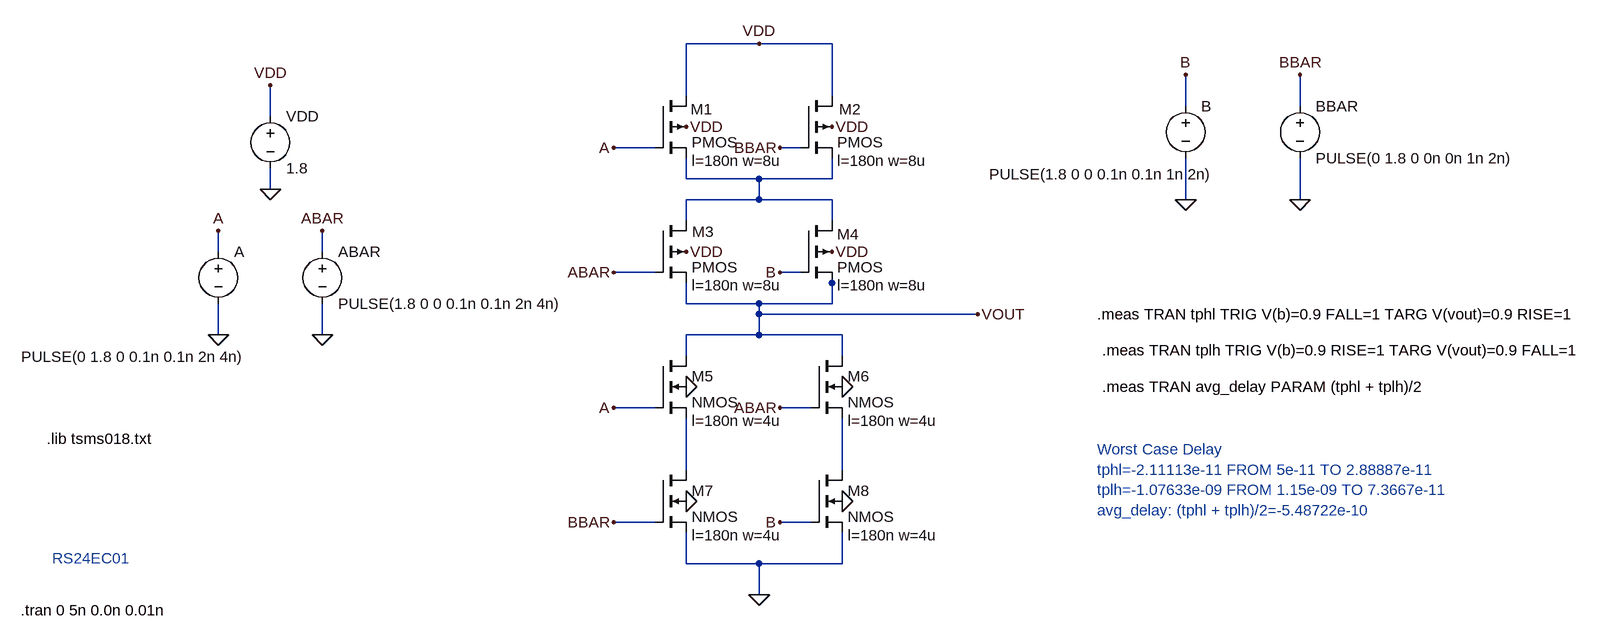
[diagram p0: schematic CMOS_XNOR_GATE.asc]
CMOS_XNOR_GATE.asc, the LTspice schematic file:
Version 4
SHEET 1 1536 872
WIRE 224 -16 112 -16
WIRE 336 -16 224 -16
WIRE 112 64 112 -16
WIRE 336 64 336 -16
WIRE 880 80 880 32
WIRE 1056 80 1056 32
WIRE -528 96 -528 48
WIRE 64 144 0 144
WIRE 288 144 256 144
WIRE 112 192 112 160
WIRE 224 192 112 192
WIRE 336 192 336 160
WIRE 336 192 224 192
WIRE -528 208 -528 176
WIRE 224 224 224 192
WIRE 224 224 112 224
WIRE 336 224 224 224
WIRE 880 224 880 160
WIRE 1056 224 1056 160
WIRE 112 256 112 224
WIRE 336 256 336 224
WIRE -608 304 -608 272
WIRE -448 304 -448 272
WIRE 64 336 0 336
WIRE 288 336 256 336
WIRE 336 352 336 336
WIRE 112 384 112 352
WIRE 224 384 112 384
WIRE 336 384 336 352
WIRE 336 384 224 384
WIRE 224 400 224 384
WIRE 560 400 224 400
WIRE -608 432 -608 384
WIRE -448 432 -448 384
WIRE 224 432 224 400
WIRE 224 432 112 432
WIRE 352 432 224 432
WIRE 112 464 112 432
WIRE 352 464 352 432
WIRE 64 544 0 544
WIRE 304 544 256 544
WIRE 112 640 112 560
WIRE 352 640 352 560
WIRE 64 720 0 720
WIRE 304 720 256 720
WIRE 112 784 112 736
WIRE 224 784 112 784
WIRE 352 784 352 736
WIRE 352 784 224 784
WIRE 224 832 224 784
FLAG 224 832 0
FLAG -528 208 0
FLAG -528 48 VDD
FLAG -608 432 0
FLAG -448 432 0
FLAG -608 272 A
FLAG -448 272 ABAR
FLAG 880 224 0
FLAG 1056 224 0
FLAG 880 32 B
FLAG 1056 32 BBAR
FLAG 224 -16 VDD
FLAG 112 512 0
FLAG 352 512 0
FLAG 112 688 0
FLAG 352 688 0
FLAG 112 112 VDD
FLAG 336 112 VDD
FLAG 112 304 VDD
FLAG 336 304 VDD
FLAG 0 144 A
FLAG 0 544 A
FLAG 256 336 B
FLAG 256 720 B
FLAG 0 336 ABAR
FLAG 256 144 BBAR
FLAG 256 544 ABAR
FLAG 0 720 BBAR
FLAG 560 400 VOUT
SYMBOL pmos4 64 64 R0
WINDOW 0 55 21 Left 2
WINDOW 123 56 100 Left 2
SYMATTR InstName M1
SYMATTR Value2 l=180n w=8u
SYMBOL pmos4 288 64 R0
WINDOW 0 59 21 Left 2
WINDOW 123 56 100 Left 2
SYMATTR InstName M2
SYMATTR Value2 l=180n w=8u
SYMBOL pmos4 64 256 R0
WINDOW 0 57 17 Left 2
WINDOW 123 56 100 Left 2
SYMATTR InstName M3
SYMATTR Value2 l=180n w=8u
SYMBOL pmos4 288 256 R0
WINDOW 0 56 21 Left 2
WINDOW 123 56 100 Left 2
SYMATTR InstName M4
SYMATTR Value2 l=180n w=8u
SYMBOL nmos4 64 464 R0
WINDOW 123 56 100 Left 2
SYMATTR Value2 l=180n w=4u
SYMATTR InstName M5
SYMBOL nmos4 304 464 R0
WINDOW 123 56 100 Left 2
SYMATTR Value2 l=180n w=4u
SYMATTR InstName M6
SYMBOL nmos4 64 640 R0
WINDOW 123 56 100 Left 2
SYMATTR Value2 l=180n w=4u
SYMATTR InstName M7
SYMBOL nmos4 304 640 R0
WINDOW 123 56 100 Left 2
SYMATTR Value2 l=180n w=4u
SYMATTR InstName M8
SYMBOL voltage -528 80 R0
WINDOW 123 0 0 Left 0
WINDOW 39 0 0 Left 0
SYMATTR InstName VDD
SYMATTR Value 1.8
SYMBOL voltage -608 288 R0
WINDOW 3 -303 178 Left 2
WINDOW 123 0 0 Left 0
WINDOW 39 0 0 Left 0
SYMATTR Value PULSE(0 1.8 0 0.1n 0.1n 2n 4n)
SYMATTR InstName A
SYMBOL voltage -448 288 R0
WINDOW 123 0 0 Left 0
WINDOW 39 0 0 Left 0
SYMATTR InstName ABAR
SYMATTR Value PULSE(1.8 0 0 0.1n 0.1n 2n 4n)
SYMBOL voltage 880 64 R0
WINDOW 3 -302 121 Left 2
WINDOW 123 0 0 Left 0
WINDOW 39 0 0 Left 0
SYMATTR Value PULSE(1.8 0 0 0.1n 0.1n 1n 2n)
SYMATTR InstName B
SYMBOL voltage 1056 64 R0
WINDOW 123 0 0 Left 0
WINDOW 39 0 0 Left 0
SYMATTR InstName BBAR
SYMATTR Value PULSE(0 1.8 0 0n 0n 1n 2n)
TEXT -912 856 Left 2 !.tran 0 5n 0.0n 0.01n
TEXT -872 592 Left 2 !.lib tsms018.txt
TEXT 744 400 Left 2 !.meas TRAN tphl TRIG V(b)=0.9 FALL=1 TARG V(vout)=0.9 RISE=1
TEXT 752 456 Left 2 !.meas TRAN tplh TRIG V(b)=0.9 RISE=1 TARG V(vout)=0.9 FALL=1
TEXT 752 512 Left 2 !.meas TRAN avg_delay PARAM (tphl + tplh)/2
TEXT 744 608 Left 2 ;Worst Case Delay\ntphl=-2.11113e-11 FROM 5e-11 TO 2.88887e-11\ntplh=-1.07633e-09 FROM 1.15e-09 TO 7.3667e-11\navg_delay: (tphl + tplh)/2=-5.48722e-10
TEXT -864 776 Left 2 ;RS24EC01

The netlist it stands for:
* CMOS_XNOR_GATE.asc
M1 VDD A N001 VDD PMOS l=180n w=8u
M2 VDD BBAR N001 VDD PMOS l=180n w=8u
M3 N001 ABAR VOUT VDD PMOS l=180n w=8u
M4 N001 B VOUT VDD PMOS l=180n w=8u
M5 VOUT A N002 0 NMOS l=180n w=4u
M6 VOUT ABAR N003 0 NMOS l=180n w=4u
M7 N002 BBAR 0 0 NMOS l=180n w=4u
M8 N003 B 0 0 NMOS l=180n w=4u
VDD VDD 0 1.8
V§A A 0 PULSE(0 1.8 0 0.1n 0.1n 2n 4n)
V§ABAR ABAR 0 PULSE(1.8 0 0 0.1n 0.1n 2n 4n)
V§B B 0 PULSE(1.8 0 0 0.1n 0.1n 1n 2n)
V§BBAR BBAR 0 PULSE(0 1.8 0 0n 0n 1n 2n)
.model NMOS NMOS
.model PMOS PMOS
.lib standard.mos
.tran 0 5n 0.0n 0.01n
.lib tsms018.txt
.meas TRAN tphl TRIG V(b)=0.9 FALL=1 TARG V(vout)=0.9 RISE=1
.meas TRAN tplh TRIG V(b)=0.9 RISE=1 TARG V(vout)=0.9 FALL=1
.meas TRAN avg_delay PARAM (tphl + tplh)/2
* Worst Case Delay
* tphl=-2.11113e-11 FROM 5e-11 TO 2.88887e-11
* tplh=-1.07633e-09 FROM 1.15e-09 TO 7.3667e-11
* avg_delay: (tphl + tplh)/2=-5.48722e-10
* RS24EC01
.backanno
.end

* Results of the author's LTspice run, read from the files saved beside the schematic
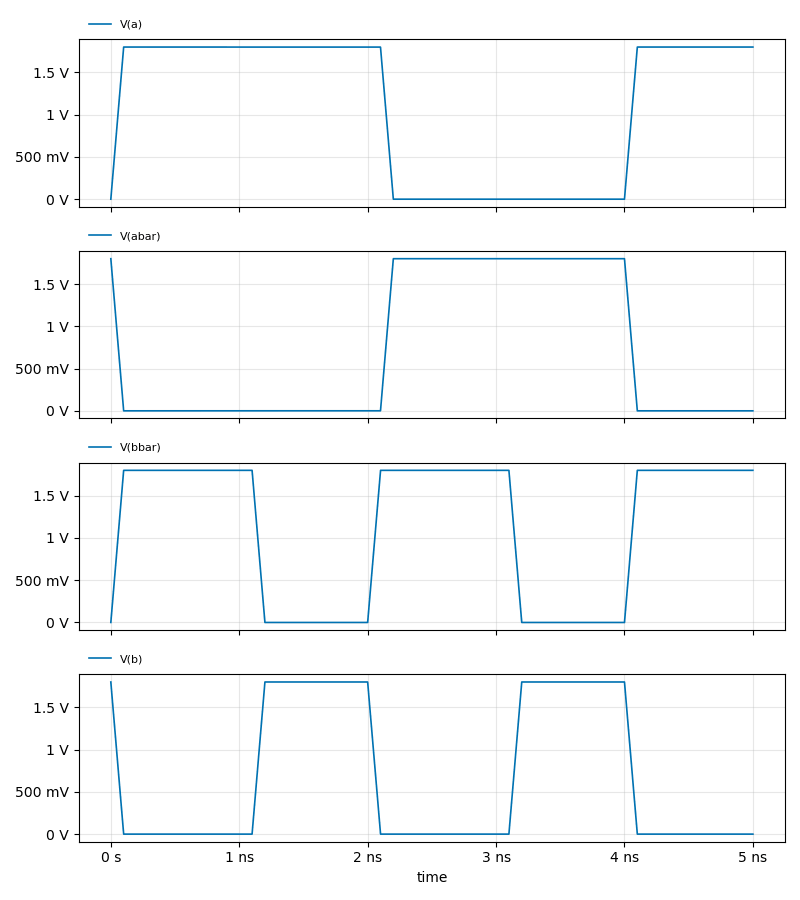
[diagram p1: Transient Analysis of CMOS_XNOR_GATE.asc, plotted from the saved traces]
* Transient Analysis, 1 run:
*   V(a): min 0 V, max 1.8 V, average 1.098 V, rms 1.394 V, last 1.8 V
*   V(abar): min 0 V, max 1.8 V, average 702 mV, rms 1.11 V, last 0 V
*   V(bbar): min 0 V, max 1.8 V, average 1.134 V, rms 1.41 V, last 1.8 V
*   V(b): min 0 V, max 1.8 V, average 666 mV, rms 1.07 V, last 0 V
* From the log:
*   tphl=-2.11113e-011 FROM 5e-011 TO 2.88887e-011
*   tplh=-1.07633e-009 FROM 1.15e-009 TO 7.3667e-011
*   avg_delay: (tphl + tplh)/2=-5.48722e-010